# Altium schematic sheet supply_internal.SchDoc: foxBMS BMS-Master
size A3; DocumentNumber: 3; SheetNumber: 3; SheetTotal: 24; Author: Fraunhofer IISB foxBMS Team; REL-DATE: 2017-05-16; VERSION: 1.0.2; SheetDescription: Supply for MCU1 and peripherals
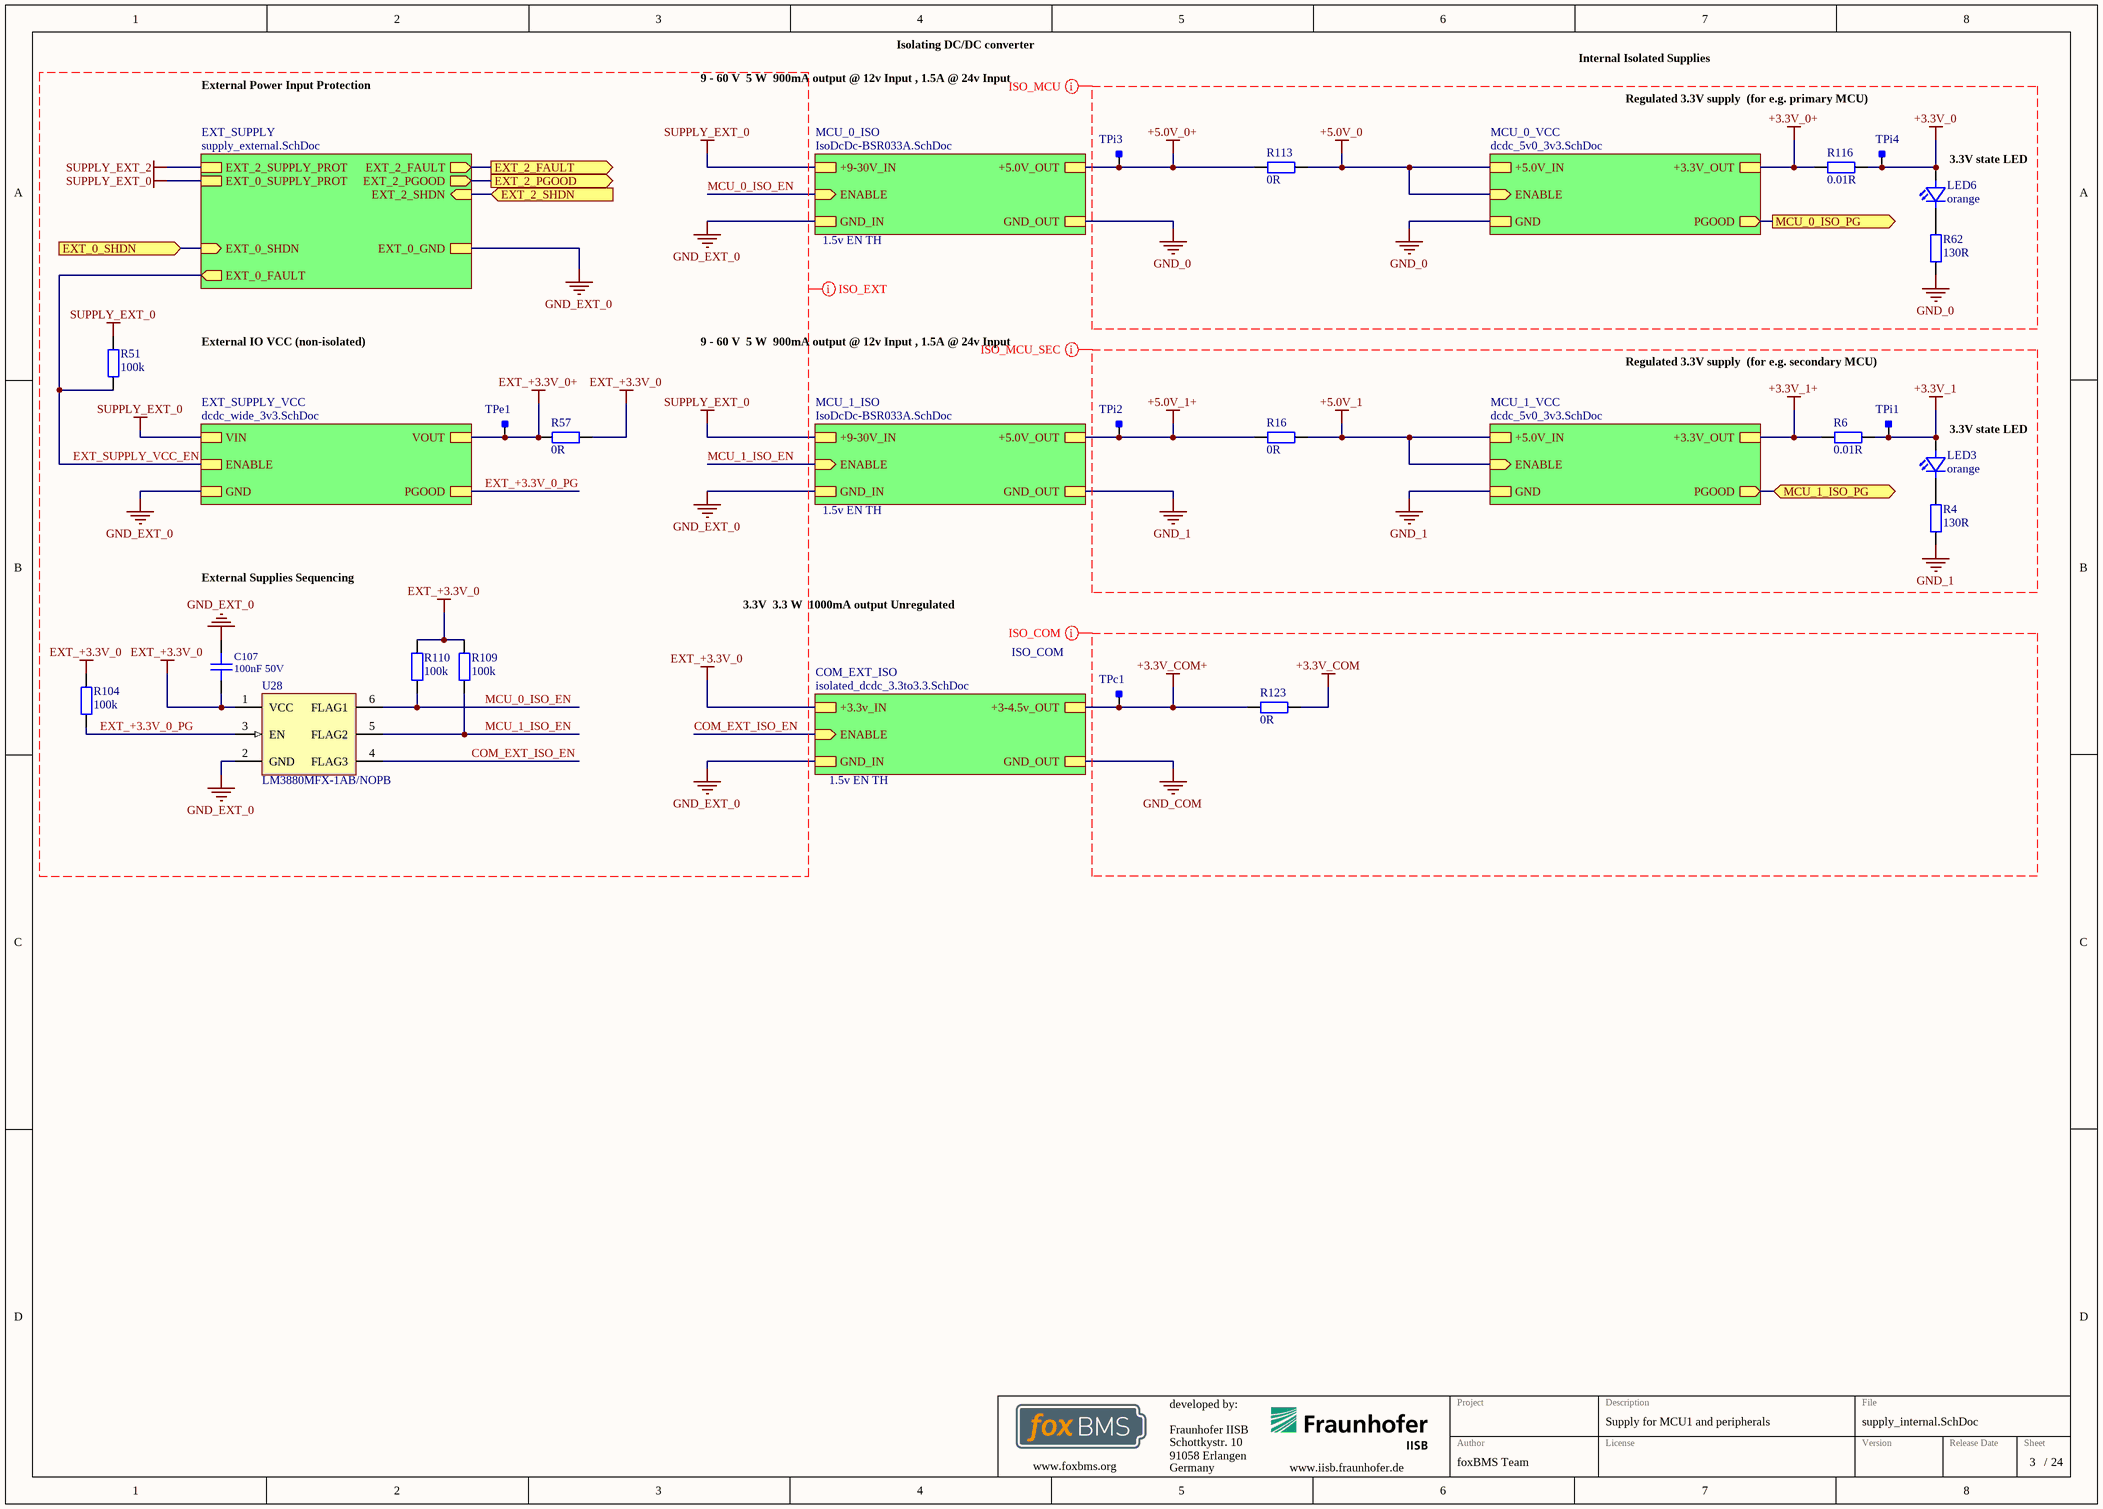
[diagram p0: supply_internal.SchDoc]

## Parts
C107  100nF 50V  [0603C]
LED3  orange  [LEDC1608X07N]
LED6  orange  [LEDC1608X07N]
R4  130R  [0603R]
R6  0.01R  [0805R]
R16  0R  [0805R]
R51  100k  [0402R]
R57  0R  [0805R]
R62  130R  [0603R]
R104  100k  [0603R]
R109  100k  [0603R]
R110  100k  [0603R]
R113  0R  [0805R]
R116  0.01R  [0805R]
R123  0R  [0805R]
TPc1  Testpoint_Square  [Testpoint_S1]  (value not drawn)  (no BOM)
TPe1  Testpoint_Square  [Testpoint_S1]  (value not drawn)  (no BOM)
TPi1  Testpoint_Square  [Testpoint_S1]  (value not drawn)  (no BOM)
TPi2  Testpoint_Square  [Testpoint_S1]  (value not drawn)  (no BOM)
TPi3  Testpoint_Square  [Testpoint_S1]  (value not drawn)  (no BOM)
TPi4  Testpoint_Square  [Testpoint_S1]  (value not drawn)  (no BOM)
U28  LM3880MFX-1AB/NOPB  [MF06A_N]

## Sub-sheets
COM_EXT_ISO = isolated_dcdc_3.3to3.3.SchDoc: ENABLE (in), +3.3v_IN, GND_OUT, +3-4.5v_OUT, GND_IN
EXT_SUPPLY = supply_external.SchDoc: EXT_2_FAULT (out), EXT_2_PGOOD (out), EXT_0_FAULT (out), EXT_2_SHDN (in), EXT_0_SHDN (in), EXT_2_SUPPLY_PROT, EXT_0_SUPPLY_PROT, EXT_0_GND
EXT_SUPPLY_VCC = dcdc_wide_3v3.SchDoc: VIN, ENABLE, PGOOD, GND, VOUT
MCU_0_ISO = IsoDcDc-BSR033A.SchDoc: ENABLE (in), +9-30V_IN, +5.0V_OUT, GND_OUT, GND_IN
MCU_0_VCC = dcdc_5v0_3v3.SchDoc: +5.0V_IN, ENABLE (in), PGOOD (out), GND, +3.3V_OUT
MCU_1_ISO = IsoDcDc-BSR033A.SchDoc: ENABLE (in), +9-30V_IN, +5.0V_OUT, GND_OUT, GND_IN
MCU_1_VCC = dcdc_5v0_3v3.SchDoc: +5.0V_IN, ENABLE (in), PGOOD (out), GND, +3.3V_OUT

## Ports
EXT_0_SHDN (in), EXT_2_FAULT (out), EXT_2_PGOOD (out), EXT_2_SHDN (in), MCU_0_ISO_PG (out), MCU_1_ISO_PG (bidir)

## Nets
+3.3V_0: LED6.2(A) R116.1 TPi4.1
+3.3V_0+: R116.2 ; sheet MCU_0_VCC/+3.3V_OUT
+3.3V_1: LED3.2(A) R6.1 TPi1.1
+3.3V_1+: R6.2 ; sheet MCU_1_VCC/+3.3V_OUT
+3.3V_COM: R123.1
+3.3V_COM+: R123.2 TPc1.1 ; sheet COM_EXT_ISO/+3-4.5v_OUT
+5.0V_0: R113.1 ; sheet MCU_0_VCC/+5.0V_IN, sheet MCU_0_VCC/ENABLE
+5.0V_0+: R113.2 TPi3.1 ; sheet MCU_0_ISO/+5.0V_OUT
+5.0V_1: R16.1 ; sheet MCU_1_VCC/+5.0V_IN, sheet MCU_1_VCC/ENABLE
+5.0V_1+: R16.2 TPi2.1 ; sheet MCU_1_ISO/+5.0V_OUT
EXT_+3.3V_0: C107.2 R57.1 R104.2 R109.2 R110.2 U28.1(VCC) ; sheet COM_EXT_ISO/+3.3v_IN
EXT_+3.3V_0+: R57.2 TPe1.1 ; sheet EXT_SUPPLY_VCC/VOUT
GND_0: R62.1 ; sheet MCU_0_ISO/GND_OUT, sheet MCU_0_VCC/GND
GND_1: R4.2 ; sheet MCU_1_ISO/GND_OUT, sheet MCU_1_VCC/GND
GND_COM: sheet COM_EXT_ISO/GND_OUT
GND_EXT_0: C107.1 U28.2(GND) ; sheet MCU_0_ISO/GND_IN, sheet MCU_1_ISO/GND_IN, sheet COM_EXT_ISO/GND_IN, sheet EXT_SUPPLY_VCC/GND, sheet EXT_SUPPLY/EXT_0_GND
SUPPLY_EXT_0: R51.2 ; sheet MCU_0_ISO/+9-30V_IN, sheet MCU_1_ISO/+9-30V_IN, sheet EXT_SUPPLY_VCC/VIN, sheet EXT_SUPPLY/EXT_0_SUPPLY_PROT
SUPPLY_EXT_2: sheet EXT_SUPPLY/EXT_2_SUPPLY_PROT
COM_EXT_ISO_EN: U28.4(FLAG3) ; sheet COM_EXT_ISO/ENABLE
EXT_0_SHDN: port EXT_0_SHDN, sheet EXT_SUPPLY/EXT_0_SHDN
EXT_2_FAULT: port EXT_2_FAULT, sheet EXT_SUPPLY/EXT_2_FAULT
EXT_2_PGOOD: port EXT_2_PGOOD, sheet EXT_SUPPLY/EXT_2_PGOOD
EXT_2_SHDN: port EXT_2_SHDN, sheet EXT_SUPPLY/EXT_2_SHDN
EXT_+3.3V_0_PG: R104.1 U28.3(EN) ; sheet EXT_SUPPLY_VCC/PGOOD
EXT_SUPPLY_VCC_EN: R51.1 ; sheet EXT_SUPPLY_VCC/ENABLE, sheet EXT_SUPPLY/EXT_0_FAULT
MCU_0_ISO_EN: R110.1 U28.6(FLAG1) ; sheet MCU_0_ISO/ENABLE
MCU_0_ISO_PG: port MCU_0_ISO_PG, sheet MCU_0_VCC/PGOOD
MCU_1_ISO_EN: R109.1 U28.5(FLAG2) ; sheet MCU_1_ISO/ENABLE
MCU_1_ISO_PG: port MCU_1_ISO_PG, sheet MCU_1_VCC/PGOOD
NetLED3_1: LED3.1(C) R4.1
NetLED6_1: LED6.1(C) R62.2

## Layout directives
net class ISO_MCU_SEC: +3.3V_1, +3.3V_1+, +5.0V_1, +5.0V_1+, GND_1
net class ISO_EXT: COM_EXT_ISO_EN, EXT_+3.3V_0, EXT_+3.3V_0+, EXT_+3.3V_0_PG, EXT_SUPPLY_VCC_EN, GND_EXT_0, MCU_0_ISO_EN, MCU_1_ISO_EN, SUPPLY_EXT_0, SUPPLY_EXT_2
net class ISO_MCU: +3.3V_0, +3.3V_0+, +5.0V_0, +5.0V_0+, GND_0
net class ISO_COM: +3.3V_COM, +3.3V_COM+, GND_COM

## Notes on the sheet
- Isolating DC/DC converter
- External Power Input Protection
- 9 - 60 V
  5 W
  900mA output @ 12v Input , 1.5A @ 24v Input
- Internal Isolated Supplies
- Regulated 3.3V supply
  (for e.g. primary MCU)
- (near LED6) 3.3V state LED
- 1.5v EN TH
- External IO VCC (non-isolated)
- Regulated 3.3V supply
  (for e.g. secondary MCU)
- (near LED3) 3.3V state LED
- External Supplies Sequencing
- 3.3V
  3.3 W
  1000mA output Unregulated
- Fraunhofer IISB
- Schottkystr. 10
- developed by:
- 91058 Erlangen
- Germany
- Author
- Project
- License
- Description
- File
- Version
- Release Date
- Sheet
- www.foxbms.org
- www.iisb.fraunhofer.de
- foxBMS Team
- /

## Library data of the parts
C107 = gen_C_ceramic_100n_50V_X7R_0603: Ceramic, 100nF, ±10%, 50V, X7R, –55 to 125°C, 0603 (1608),RoHS, Automotive; Part Number: GCJ188R71H104KA12; Manufacturer: Murata; Capacitance: 100n; Case EIA: 0603; Case Metric: 1608; Automotive Qualified: True; PnP Package: C_0603_10; PnP Value: 100nF/50V/X7R; Dielectric: X7R; Rated Voltage: 50V; Height - Seated (Max): 0.8mm; Mounting Type: SurfaceMount,MLCC; Operating Temperature: –55 to 125°C; Series: GCJ; Tolerance: ±10%; Manufacturer_Part_Number: GCJ188R71H104KA12; Supplier 1: Digi-Key; Supplier Part Number 1: 490-5798-1-ND
LED3 LED6 = gen_LED_0603_orange: LED; Breakdown Voltage: 5V; Continuous Forward Current: 20mA; Forward Voltage @ 20mA: 2.2V; Automotive Qualified: False; Case EIA: 0603; Case Metric: 1608; Part Number: gen_LED_0603_orange; Color: orange; PnP Package: LED_0603; Supplier 1: Farnell; Supplier Part Number 1: 2099222
R4 R62 = gen_R_130R_0603: SMD Resistor 130R 0603; Tolerance: 1%; Power: 0.1W; Case EIA: 0603; Case Metric: 1608; Maximum Working Voltage: 75V; PnP Package: R_0603; Automotive Qualified: False; Part Number: gen_R_130R_0603; Operating Temperature: -55°C - +155°C; Resistance: 130R; Series: E24, E96; PnP Value: 130R; Supplier 1: Farnell; Supplier Part Number 1: 2379959
R6 R116 = gen_R_0.01R_0805: SMD Resistor 10m 0805; Case EIA: 0805; Case Metric: 2012; PnP Package: R_0603; Operating Temperature: -55°C - +155°C; PnP Value: 0.01R; Part Number: gen_R_0.01R_0805
R16 R57 R113 R123 = gen_R_0.01R_0805: SMD Resistor 10m 0805; Case EIA: 0805; Case Metric: 2012; PnP Package: R_0603; PnP Value: 0.01R; Operating Temperature: -55°C - +155°C; Part Number: gen_R_0.01R_0805
R51 = gen_R_100k_0402: SMD Resistor 100k 0402; Case EIA: 0402; Case Metric: 1005; PnP Package: R_0402; Automotive Qualified: False; PnP Value: 100k; Operating Temperature: -55°C - +155°C; Part Number: gen_R_100k_0402
R104 R109 R110 = gen_R_100k_0603: SMD Resistor 100k 0603; Case EIA: 0603; Case Metric: 1608; PnP Package: R_0603; Automotive Qualified: False; PnP Value: 100k; Operating Temperature: -55°C - +155°C; Part Number: gen_R_100k_0603
TPc1 TPe1 TPi1-TPi4 = Testpoint_Square: Testpoint, square; Part Number: Testpoint_Square
U28 = CMP-0063-01010-1: Power Sequencer, 6-pin SOT-23, Pb-Free; Manufacturer: National Semiconductor; CompType: MiscPower; PowerWise: N; PackageTopMarking: F21A*XTT; DatasheetVersion: May-2008; PinCount: 6; Code_JEDEC: MO-178-AB; PackageReference: MF06A; Code_IPC: SOT26A-6; RoHS: Y; PackageDescription: Molded SOT-23, .115 x .063 x .040in Body, 6 Lead, .0375in in Pitch; PackageVersion: revC, Sep-2005